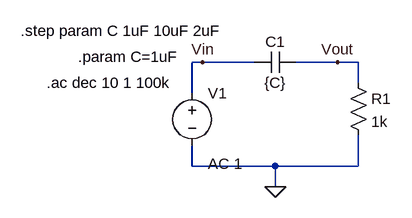
[diagram p0: schematic test1.asc]
test1.asc, the LTspice schematic file:
Version 4
SHEET 1 880 680
WIRE 80 112 64 112
WIRE 160 112 80 112
WIRE 288 112 224 112
WIRE 320 112 288 112
WIRE 320 144 320 112
WIRE 64 160 64 112
WIRE 64 272 64 240
WIRE 192 272 64 272
WIRE 320 272 320 224
WIRE 320 272 192 272
WIRE 192 304 192 272
FLAG 192 304 0
FLAG 80 112 Vin
FLAG 288 112 Vout
SYMBOL voltage 64 144 R0
WINDOW 123 24 124 Left 2
WINDOW 39 0 0 Left 2
SYMATTR InstName V1
SYMATTR Value ""
SYMATTR Value2 AC 1
SYMBOL cap 224 96 R90
WINDOW 0 0 32 VBottom 2
WINDOW 3 32 32 VTop 2
SYMATTR InstName C1
SYMATTR Value {C}
SYMBOL res 304 128 R0
SYMATTR InstName R1
SYMATTR Value 1k
TEXT -160 144 Left 2 !.ac dec 10 1 100k
TEXT -200 64 Left 2 !.step param C 1uF 10uF 2uF
TEXT -112 104 Left 2 !.param C=1uF

The netlist it stands for:
* test1.asc
V1 Vin 0 AC 1
C1 Vout Vin {C}
R1 Vout 0 1k
.ac dec 10 1 100k
.step param C 1uF 10uF 2uF
.param C=1uF
.backanno
.end